# Altium schematic sheet Signal_switch.SchDoc
size A3; Organization: Altium Limited; Address1: L3, 12a Rodborough Rd; Address2: Frenchs Forest; Address3: NSW; Address4: Australia 2086
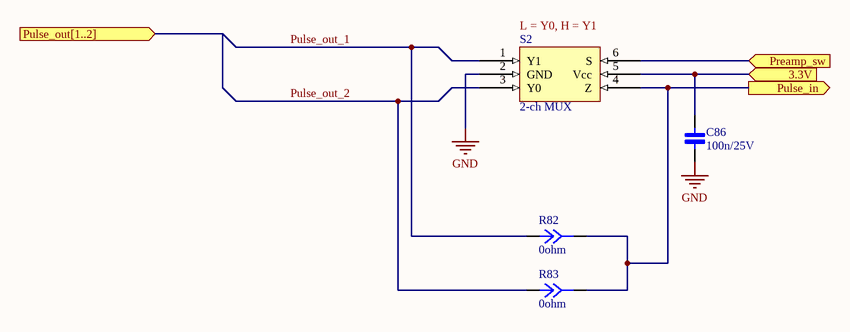
[diagram p0: Signal_switch.SchDoc]

## Parts
C86  100n/25V  [CAP_0603]
R82  0ohm  [Jumper]
R83  0ohm  [Jumper]
S2  2-ch MUX  [TSOP6]

## Ports
3.3V (in), Preamp_sw (in), Pulse_in (out), Pulse_out[1..2] (in)

## Nets
GND: C86.1 S2.2(GND)
3.3V: C86.2 S2.5(Vcc) ; port 3.3V
Preamp_sw: S2.6(S) ; port Preamp_sw
Pulse_in: R82.2 R83.2 S2.4(Z) ; port Pulse_in
Pulse_out_1: R82.2 S2.1(Y1)
Pulse_out_2: R83.2 S2.3(Y0)

## Notes on the sheet
- (near S2) L = Y0, H = Y1
- Title
- Size:
- Date:
- A3
- Number:
- Time:
- Revision:
- Sheet
- of
- File:

## Library data of the parts
C86 = Cap_0603_100n: Ceramic Capacitor 100n / 0603 / 25V / ±5%, Wurth Elektronik MLCC; ComponentLink1Description: New link; ComponentLink1URL: https://www.we-online.com/catalog/en/WCAP-CSGP-25VDC
R82 R83 = Jumper
S2 = 74LVC1G3157-Q100: 2-channel analog multiplexer/demultiplexernexperia